# EAGLE schematic reva (EAGLE 9.6.2)

## Sheet 1 of 2
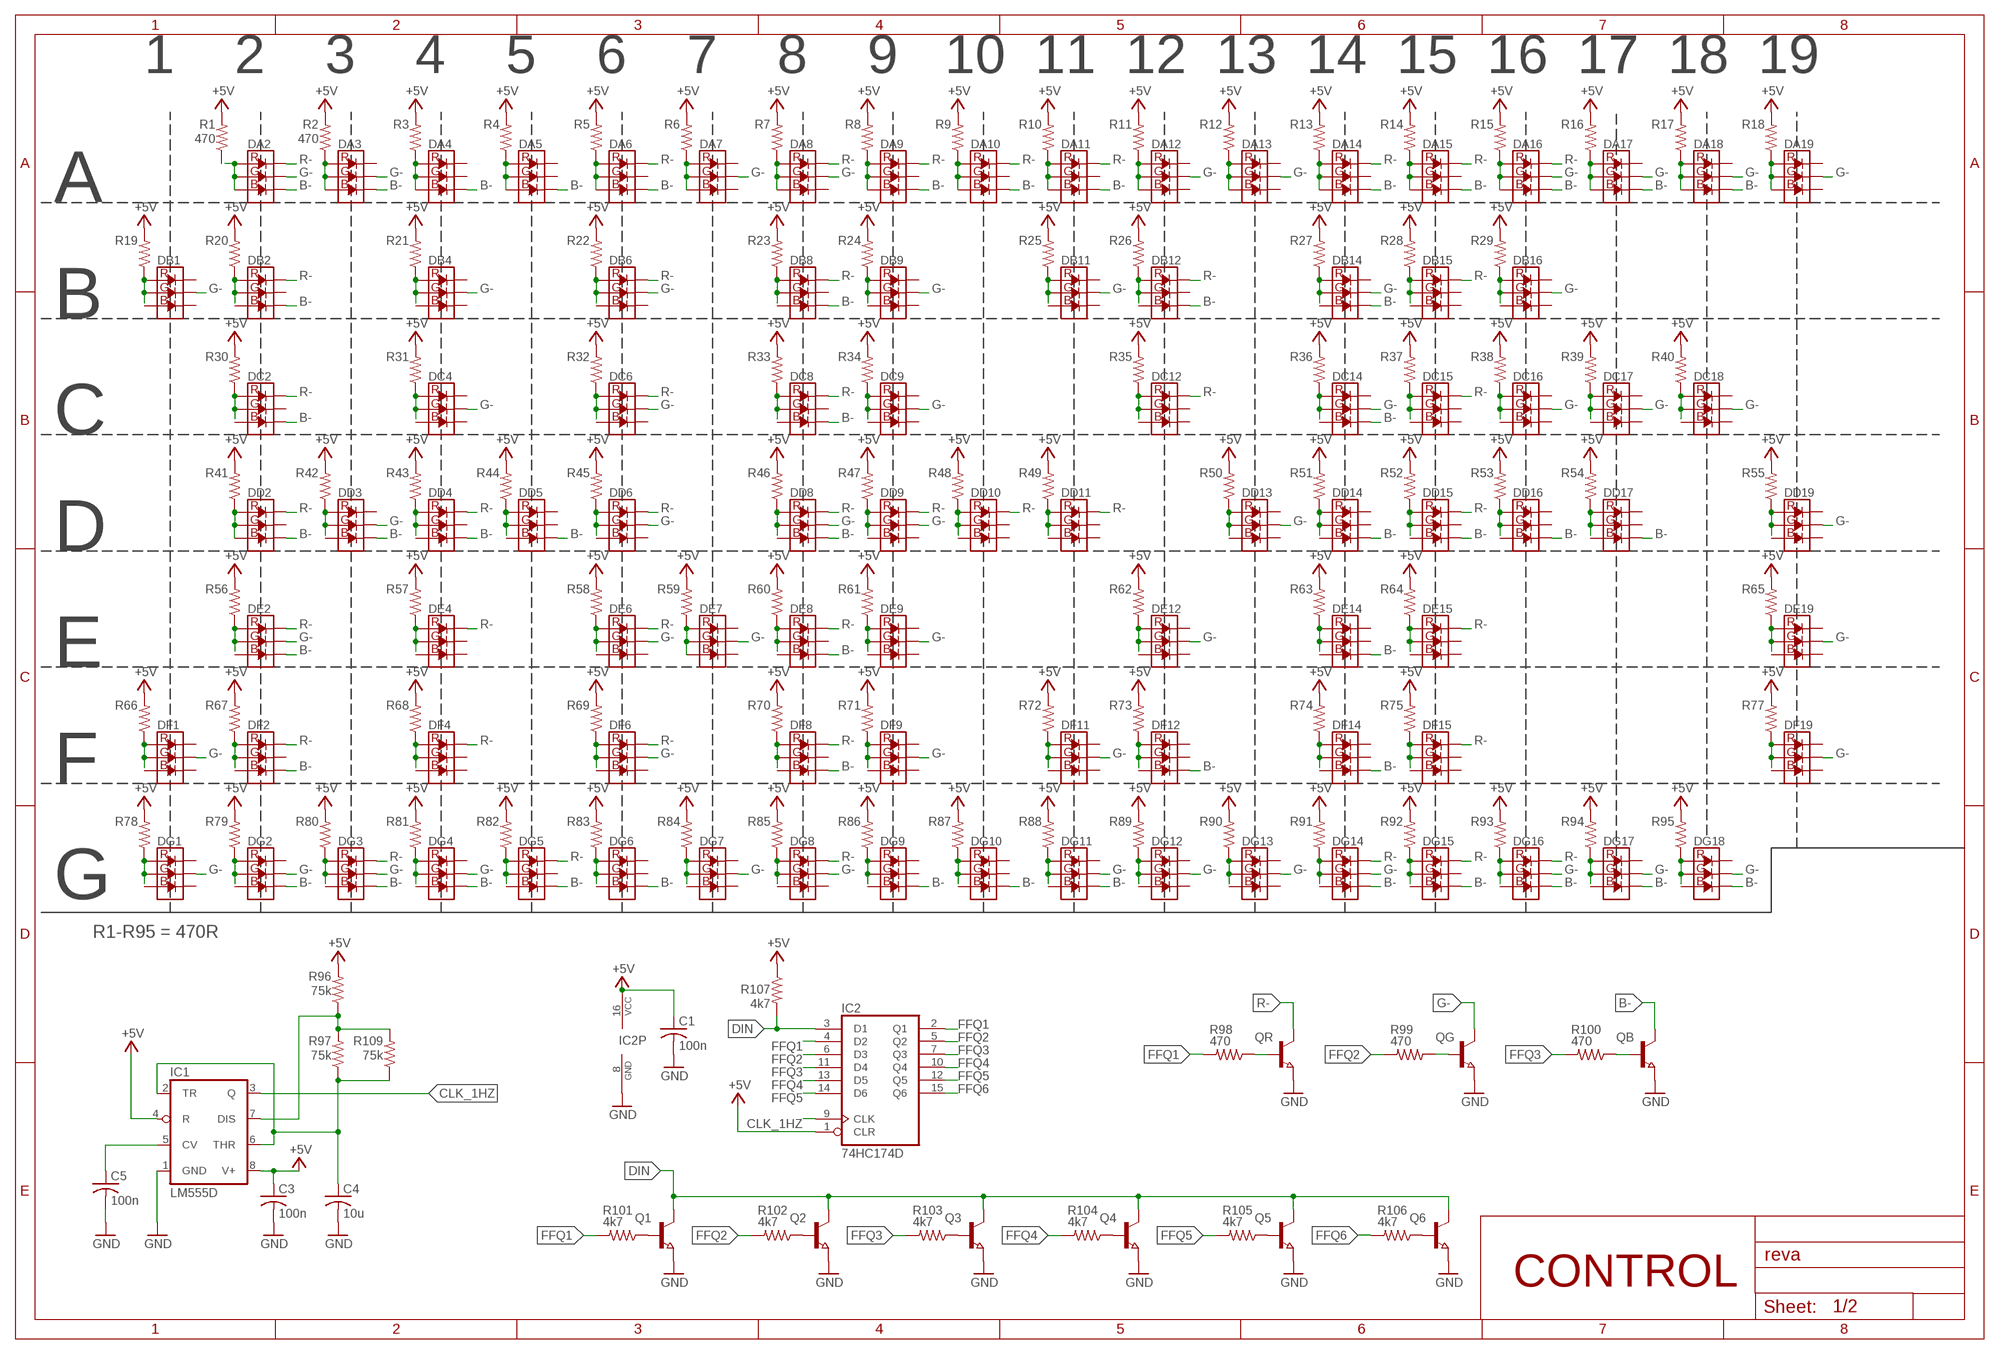
[diagram p0: schematic, sheet 1]

### Parts
C1  100n  C-USC0603  [C0603]
C3  100n  C-USC0603  [C0603]
C4  10u  C-USC0805  [C0805]
C5  100n  C-USC0603  [C0603]
DA2  RGB_LED_XL  [LED2727]
DA3  RGB_LED_XL  [LED2727]
DA4  RGB_LED_XL  [LED2727]
DA5  RGB_LED_XL  [LED2727]
DA6  RGB_LED_XL  [LED2727]
DA7  RGB_LED_XL  [LED2727]
DA8  RGB_LED_XL  [LED2727]
DA9  RGB_LED_XL  [LED2727]
DA10  RGB_LED_XL  [LED2727]
DA11  RGB_LED_XL  [LED2727]
DA12  RGB_LED_XL  [LED2727]
DA13  RGB_LED_XL  [LED2727]
DA14  RGB_LED_XL  [LED2727]
DA15  RGB_LED_XL  [LED2727]
DA16  RGB_LED_XL  [LED2727]
DA17  RGB_LED_XL  [LED2727]
DA18  RGB_LED_XL  [LED2727]
DA19  RGB_LED_XL  [LED2727]
DB1  RGB_LED_XL  [LED2727]
DB2  RGB_LED_XL  [LED2727]
DB4  RGB_LED_XL  [LED2727]
DB6  RGB_LED_XL  [LED2727]
DB8  RGB_LED_XL  [LED2727]
DB9  RGB_LED_XL  [LED2727]
DB11  RGB_LED_XL  [LED2727]
DB12  RGB_LED_XL  [LED2727]
DB14  RGB_LED_XL  [LED2727]
DB15  RGB_LED_XL  [LED2727]
DB16  RGB_LED_XL  [LED2727]
DC2  RGB_LED_XL  [LED2727]
DC4  RGB_LED_XL  [LED2727]
DC6  RGB_LED_XL  [LED2727]
DC8  RGB_LED_XL  [LED2727]
DC9  RGB_LED_XL  [LED2727]
DC12  RGB_LED_XL  [LED2727]
DC14  RGB_LED_XL  [LED2727]
DC15  RGB_LED_XL  [LED2727]
DC16  RGB_LED_XL  [LED2727]
DC17  RGB_LED_XL  [LED2727]
DC18  RGB_LED_XL  [LED2727]
DD2  RGB_LED_XL  [LED2727]
DD3  RGB_LED_XL  [LED2727]
DD4  RGB_LED_XL  [LED2727]
DD5  RGB_LED_XL  [LED2727]
DD6  RGB_LED_XL  [LED2727]
DD8  RGB_LED_XL  [LED2727]
DD9  RGB_LED_XL  [LED2727]
DD10  RGB_LED_XL  [LED2727]
DD11  RGB_LED_XL  [LED2727]
DD13  RGB_LED_XL  [LED2727]
DD14  RGB_LED_XL  [LED2727]
DD15  RGB_LED_XL  [LED2727]
DD16  RGB_LED_XL  [LED2727]
DD17  RGB_LED_XL  [LED2727]
DD19  RGB_LED_XL  [LED2727]
DE2  RGB_LED_XL  [LED2727]
DE4  RGB_LED_XL  [LED2727]
DE6  RGB_LED_XL  [LED2727]
DE7  RGB_LED_XL  [LED2727]
DE8  RGB_LED_XL  [LED2727]
DE9  RGB_LED_XL  [LED2727]
DE12  RGB_LED_XL  [LED2727]
DE14  RGB_LED_XL  [LED2727]
DE15  RGB_LED_XL  [LED2727]
DE19  RGB_LED_XL  [LED2727]
DF1  RGB_LED_XL  [LED2727]
DF2  RGB_LED_XL  [LED2727]
DF4  RGB_LED_XL  [LED2727]
DF6  RGB_LED_XL  [LED2727]
DF8  RGB_LED_XL  [LED2727]
DF9  RGB_LED_XL  [LED2727]
DF11  RGB_LED_XL  [LED2727]
DF12  RGB_LED_XL  [LED2727]
DF14  RGB_LED_XL  [LED2727]
DF15  RGB_LED_XL  [LED2727]
DF19  RGB_LED_XL  [LED2727]
DG1  RGB_LED_XL  [LED2727]
DG2  RGB_LED_XL  [LED2727]
DG3  RGB_LED_XL  [LED2727]
DG4  RGB_LED_XL  [LED2727]
DG5  RGB_LED_XL  [LED2727]
DG6  RGB_LED_XL  [LED2727]
DG7  RGB_LED_XL  [LED2727]
DG8  RGB_LED_XL  [LED2727]
DG9  RGB_LED_XL  [LED2727]
DG10  RGB_LED_XL  [LED2727]
DG11  RGB_LED_XL  [LED2727]
DG12  RGB_LED_XL  [LED2727]
DG13  RGB_LED_XL  [LED2727]
DG14  RGB_LED_XL  [LED2727]
DG15  RGB_LED_XL  [LED2727]
DG16  RGB_LED_XL  [LED2727]
DG17  RGB_LED_XL  [LED2727]
DG18  RGB_LED_XL  [LED2727]
IC1  LM555D  [SO08]
IC2  74HC174D  74LS174D  [SO16]
Q1  NPN-TRANSISTOR_SOT23  [SOT23]
Q2  NPN-TRANSISTOR_SOT23  [SOT23]
Q3  NPN-TRANSISTOR_SOT23  [SOT23]
Q4  NPN-TRANSISTOR_SOT23  [SOT23]
Q5  NPN-TRANSISTOR_SOT23  [SOT23]
Q6  NPN-TRANSISTOR_SOT23  [SOT23]
QB  NPN-TRANSISTOR_SOT23  [SOT23]
QG  NPN-TRANSISTOR_SOT23  [SOT23]
QR  NPN-TRANSISTOR_SOT23  [SOT23]
R1  470  R-US_R0603  [R0603]
R2  470  R-US_R0603  [R0603]
R3  R-US_R0603  [R0603]
R4  R-US_R0603  [R0603]
R5  R-US_R0603  [R0603]
R6  R-US_R0603  [R0603]
R7  R-US_R0603  [R0603]
R8  R-US_R0603  [R0603]
R9  R-US_R0603  [R0603]
R10  R-US_R0603  [R0603]
R11  R-US_R0603  [R0603]
R12  R-US_R0603  [R0603]
R13  R-US_R0603  [R0603]
R14  R-US_R0603  [R0603]
R15  R-US_R0603  [R0603]
R16  R-US_R0603  [R0603]
R17  R-US_R0603  [R0603]
R18  R-US_R0603  [R0603]
R19  R-US_R0603  [R0603]
R20  R-US_R0603  [R0603]
R21  R-US_R0603  [R0603]
R22  R-US_R0603  [R0603]
R23  R-US_R0603  [R0603]
R24  R-US_R0603  [R0603]
R25  R-US_R0603  [R0603]
R26  R-US_R0603  [R0603]
R27  R-US_R0603  [R0603]
R28  R-US_R0603  [R0603]
R29  R-US_R0603  [R0603]
R30  R-US_R0603  [R0603]
R31  R-US_R0603  [R0603]
R32  R-US_R0603  [R0603]
R33  R-US_R0603  [R0603]
R34  R-US_R0603  [R0603]
R35  R-US_R0603  [R0603]
R36  R-US_R0603  [R0603]
R37  R-US_R0603  [R0603]
R38  R-US_R0603  [R0603]
R39  R-US_R0603  [R0603]
R40  R-US_R0603  [R0603]
R41  R-US_R0603  [R0603]
R42  R-US_R0603  [R0603]
R43  R-US_R0603  [R0603]
R44  R-US_R0603  [R0603]
R45  R-US_R0603  [R0603]
R46  R-US_R0603  [R0603]
R47  R-US_R0603  [R0603]
R48  R-US_R0603  [R0603]
R49  R-US_R0603  [R0603]
R50  R-US_R0603  [R0603]
R51  R-US_R0603  [R0603]
R52  R-US_R0603  [R0603]
R53  R-US_R0603  [R0603]
R54  R-US_R0603  [R0603]
R55  R-US_R0603  [R0603]
R56  R-US_R0603  [R0603]
R57  R-US_R0603  [R0603]
R58  R-US_R0603  [R0603]
R59  R-US_R0603  [R0603]
R60  R-US_R0603  [R0603]
R61  R-US_R0603  [R0603]
R62  R-US_R0603  [R0603]
R63  R-US_R0603  [R0603]
R64  R-US_R0603  [R0603]
R65  R-US_R0603  [R0603]
R66  R-US_R0603  [R0603]
R67  R-US_R0603  [R0603]
R68  R-US_R0603  [R0603]
R69  R-US_R0603  [R0603]
R70  R-US_R0603  [R0603]
R71  R-US_R0603  [R0603]
R72  R-US_R0603  [R0603]
R73  R-US_R0603  [R0603]
R74  R-US_R0603  [R0603]
R75  R-US_R0603  [R0603]
R77  R-US_R0603  [R0603]
R78  R-US_R0603  [R0603]
R79  R-US_R0603  [R0603]
R80  R-US_R0603  [R0603]
R81  R-US_R0603  [R0603]
R82  R-US_R0603  [R0603]
R83  R-US_R0603  [R0603]
R84  R-US_R0603  [R0603]
R85  R-US_R0603  [R0603]
R86  R-US_R0603  [R0603]
R87  R-US_R0603  [R0603]
R88  R-US_R0603  [R0603]
R89  R-US_R0603  [R0603]
R90  R-US_R0603  [R0603]
R91  R-US_R0603  [R0603]
R92  R-US_R0603  [R0603]
R93  R-US_R0603  [R0603]
R94  R-US_R0603  [R0603]
R95  R-US_R0603  [R0603]
R96  75k  R-US_R0603  [R0603]
R97  75k  R-US_R0603  [R0603]
R98  470  R-US_R0603  [R0603]
R99  470  R-US_R0603  [R0603]
R100  470  R-US_R0603  [R0603]
R101  4k7  R-US_R0603  [R0603]
R102  4k7  R-US_R0603  [R0603]
R103  4k7  R-US_R0603  [R0603]
R104  4k7  R-US_R0603  [R0603]
R105  4k7  R-US_R0603  [R0603]
R106  4k7  R-US_R0603  [R0603]
R107  4k7  R-US_R0603  [R0603]
R109  75k  R-US_R0603  [R0603]

### Nets
+5V: C1.1 C3.1 IC1.4(R) IC1.8(V+) IC2.1(CLR) IC2.16(VCC) R1.2 R2.2 R3.2 R4.2 R5.2 R6.2 R7.2 R8.2 R9.2 R10.2 R11.2 R12.2 R13.2 R14.2 R15.2 R16.2 R17.2 R18.2 R19.2 R20.2 R21.2 R22.2 R23.2 R24.2 R25.2 R26.2 R27.2 R28.2 R29.2 R30.2 R31.2 R32.2 R33.2 R34.2 R35.2 R36.2 R37.2 R38.2 R39.2 R40.2 R41.2 R42.2 R43.2 R44.2 R45.2 R46.2 R47.2 R48.2 R49.2 R50.2 R51.2 R52.2 R53.2 R54.2 R55.2 R56.2 R57.2 R58.2 R59.2 R60.2 R61.2 R62.2 R63.2 R64.2 R65.2 R66.2 R67.2 R68.2 R69.2 R70.2 R71.2 R72.2 R73.2 R74.2 R75.2 R77.2 R78.2 R79.2 R80.2 R81.2 R82.2 R83.2 R84.2 R85.2 R86.2 R87.2 R88.2 R89.2 R90.2 R91.2 R92.2 R93.2 R94.2 R95.2 R96.2 R107.1 ; also sheet 2
B-: DA2.1(B-) DA3.1(B-) DA4.1(B-) DA5.1(B-) DA6.1(B-) DA9.1(B-) DA10.1(B-) DA11.1(B-) DA14.1(B-) DA15.1(B-) DA16.1(B-) DA17.1(B-) DA18.1(B-) DB2.1(B-) DB8.1(B-) DB12.1(B-) DB14.1(B-) DC2.1(B-) DC8.1(B-) DC14.1(B-) DD2.1(B-) DD3.1(B-) DD4.1(B-) DD5.1(B-) DD8.1(B-) DD14.1(B-) DD15.1(B-) DD16.1(B-) DD17.1(B-) DE2.1(B-) DE8.1(B-) DE14.1(B-) DF2.1(B-) DF8.1(B-) DF12.1(B-) DF14.1(B-) DG2.1(B-) DG3.1(B-) DG4.1(B-) DG5.1(B-) DG6.1(B-) DG9.1(B-) DG10.1(B-) DG11.1(B-) DG14.1(B-) DG15.1(B-) DG16.1(B-) DG17.1(B-) DG18.1(B-) QB.3(C)
CLK_1HZ: IC1.3(Q) IC2.9(CLK)
CV: C5.1 IC1.5(CV)
DIN: IC2.3(D1) Q1.3(C) Q2.3(C) Q3.3(C) Q4.3(C) Q5.3(C) Q6.3(C) R107.2
DIS: IC1.7(DIS) R96.1 R97.2 R109.2
FFQ1: IC2.2(Q1) IC2.4(D2) R98.2 R101.2
FFQ2: IC2.5(Q2) IC2.6(D3) R99.2 R102.2
FFQ3: IC2.7(Q3) IC2.11(D4) R100.2 R103.2
FFQ4: IC2.10(Q4) IC2.13(D5) R104.2
FFQ5: IC2.12(Q5) IC2.14(D6) R105.2
FFQ6: IC2.15(Q6) R106.2
G-: DA2.2(G-) DA3.2(G-) DA7.2(G-) DA8.2(G-) DA12.2(G-) DA13.2(G-) DA16.2(G-) DA17.2(G-) DA18.2(G-) DA19.2(G-) DB1.2(G-) DB4.2(G-) DB6.2(G-) DB9.2(G-) DB11.2(G-) DB14.2(G-) DB16.2(G-) DC4.2(G-) DC6.2(G-) DC9.2(G-) DC14.2(G-) DC16.2(G-) DC17.2(G-) DC18.2(G-) DD3.2(G-) DD6.2(G-) DD8.2(G-) DD9.2(G-) DD13.2(G-) DD19.2(G-) DE2.2(G-) DE6.2(G-) DE7.2(G-) DE9.2(G-) DE12.2(G-) DE19.2(G-) DF1.2(G-) DF6.2(G-) DF9.2(G-) DF11.2(G-) DF19.2(G-) DG1.2(G-) DG2.2(G-) DG3.2(G-) DG4.2(G-) DG7.2(G-) DG8.2(G-) DG11.2(G-) DG12.2(G-) DG13.2(G-) DG14.2(G-) DG16.2(G-) DG17.2(G-) DG18.2(G-) QG.3(C)
GND: C1.2 C3.2 C4.2 C5.2 IC1.1(GND) IC2.8(GND) Q1.2(E) Q2.2(E) Q3.2(E) Q4.2(E) Q5.2(E) Q6.2(E) QB.2(E) QG.2(E) QR.2(E) ; also sheet 2
N$1: DA2.4(R+) DA2.5(G+) DA2.6(B+) R1.1
N$2: DA3.4(R+) DA3.5(G+) DA3.6(B+) R2.1
N$3: DA4.4(R+) DA4.5(G+) DA4.6(B+) R3.1
N$4: DA5.4(R+) DA5.5(G+) DA5.6(B+) R4.1
N$5: DA6.4(R+) DA6.5(G+) DA6.6(B+) R5.1
N$6: DA7.4(R+) DA7.5(G+) DA7.6(B+) R6.1
N$7: DA8.4(R+) DA8.5(G+) DA8.6(B+) R7.1
N$8: DA9.4(R+) DA9.5(G+) DA9.6(B+) R8.1
N$9: DA10.4(R+) DA10.5(G+) DA10.6(B+) R9.1
N$10: DA11.4(R+) DA11.5(G+) DA11.6(B+) R10.1
N$11: DA12.4(R+) DA12.5(G+) DA12.6(B+) R11.1
N$12: DA13.4(R+) DA13.5(G+) DA13.6(B+) R12.1
N$13: DA14.4(R+) DA14.5(G+) DA14.6(B+) R13.1
N$14: DA15.4(R+) DA15.5(G+) DA15.6(B+) R14.1
N$15: DA16.4(R+) DA16.5(G+) DA16.6(B+) R15.1
N$16: DA17.4(R+) DA17.5(G+) DA17.6(B+) R16.1
N$17: DA18.4(R+) DA18.5(G+) DA18.6(B+) R17.1
N$18: DA19.4(R+) DA19.5(G+) DA19.6(B+) R18.1
N$19: DB1.4(R+) DB1.5(G+) DB1.6(B+) R19.1
N$20: DB2.4(R+) DB2.5(G+) DB2.6(B+) R20.1
N$21: DB4.4(R+) DB4.5(G+) DB4.6(B+) R21.1
N$22: DB6.4(R+) DB6.5(G+) DB6.6(B+) R22.1
N$23: DB8.4(R+) DB8.5(G+) DB8.6(B+) R23.1
N$24: DB9.4(R+) DB9.5(G+) DB9.6(B+) R24.1
N$25: DB11.4(R+) DB11.5(G+) DB11.6(B+) R25.1
N$26: DB12.4(R+) DB12.5(G+) DB12.6(B+) R26.1
N$27: DB14.4(R+) DB14.5(G+) DB14.6(B+) R27.1
N$28: DB15.4(R+) DB15.5(G+) DB15.6(B+) R28.1
N$29: DB16.4(R+) DB16.5(G+) DB16.6(B+) R29.1
N$30: DC2.4(R+) DC2.5(G+) DC2.6(B+) R30.1
N$31: DC4.4(R+) DC4.5(G+) DC4.6(B+) R31.1
N$32: DC6.4(R+) DC6.5(G+) DC6.6(B+) R32.1
N$33: DC8.4(R+) DC8.5(G+) DC8.6(B+) R33.1
N$34: DC9.4(R+) DC9.5(G+) DC9.6(B+) R34.1
N$35: DC12.4(R+) DC12.5(G+) DC12.6(B+) R35.1
N$36: DC14.4(R+) DC14.5(G+) DC14.6(B+) R36.1
N$37: DC15.4(R+) DC15.5(G+) DC15.6(B+) R37.1
N$38: DC16.4(R+) DC16.5(G+) DC16.6(B+) R38.1
N$39: DC17.4(R+) DC17.5(G+) DC17.6(B+) R39.1
N$40: DC18.4(R+) DC18.5(G+) DC18.6(B+) R40.1
N$41: DD2.4(R+) DD2.5(G+) DD2.6(B+) R41.1
N$42: DD3.4(R+) DD3.5(G+) DD3.6(B+) R42.1
N$43: DD4.4(R+) DD4.5(G+) DD4.6(B+) R43.1
N$44: DD5.4(R+) DD5.5(G+) DD5.6(B+) R44.1
N$45: DD6.4(R+) DD6.5(G+) DD6.6(B+) R45.1
N$46: DD8.4(R+) DD8.5(G+) DD8.6(B+) R46.1
N$47: DD9.4(R+) DD9.5(G+) DD9.6(B+) R47.1
N$48: DD10.4(R+) DD10.5(G+) DD10.6(B+) R48.1
N$49: DD11.4(R+) DD11.5(G+) DD11.6(B+) R49.1
N$50: DD13.4(R+) DD13.5(G+) DD13.6(B+) R50.1
N$51: DD14.4(R+) DD14.5(G+) DD14.6(B+) R51.1
N$52: DD15.4(R+) DD15.5(G+) DD15.6(B+) R52.1
N$53: DD16.4(R+) DD16.5(G+) DD16.6(B+) R53.1
N$54: DD17.4(R+) DD17.5(G+) DD17.6(B+) R54.1
N$55: DD19.4(R+) DD19.5(G+) DD19.6(B+) R55.1
N$56: DE2.4(R+) DE2.5(G+) DE2.6(B+) R56.1
N$57: DE4.4(R+) DE4.5(G+) DE4.6(B+) R57.1
N$58: DE6.4(R+) DE6.5(G+) DE6.6(B+) R58.1
N$59: DE7.4(R+) DE7.5(G+) DE7.6(B+) R59.1
N$60: DE8.4(R+) DE8.5(G+) DE8.6(B+) R60.1
N$61: DE9.4(R+) DE9.5(G+) DE9.6(B+) R61.1
N$62: DE12.4(R+) DE12.5(G+) DE12.6(B+) R62.1
N$63: DE14.4(R+) DE14.5(G+) DE14.6(B+) R63.1
N$64: DE15.4(R+) DE15.5(G+) DE15.6(B+) R64.1
N$65: DE19.4(R+) DE19.5(G+) DE19.6(B+) R65.1
N$66: DF1.4(R+) DF1.5(G+) DF1.6(B+) R66.1
N$67: DF2.4(R+) DF2.5(G+) DF2.6(B+) R67.1
N$68: DF4.4(R+) DF4.5(G+) DF4.6(B+) R68.1
N$69: DF6.4(R+) DF6.5(G+) DF6.6(B+) R69.1
N$70: DF8.4(R+) DF8.5(G+) DF8.6(B+) R70.1
N$71: DF9.4(R+) DF9.5(G+) DF9.6(B+) R71.1
N$72: DF11.4(R+) DF11.5(G+) DF11.6(B+) R72.1
N$73: DF12.4(R+) DF12.5(G+) DF12.6(B+) R73.1
N$74: DF14.4(R+) DF14.5(G+) DF14.6(B+) R74.1
N$75: DF15.4(R+) DF15.5(G+) DF15.6(B+) R75.1
N$77: DF19.4(R+) DF19.5(G+) DF19.6(B+) R77.1
N$78: DG1.4(R+) DG1.5(G+) DG1.6(B+) R78.1
N$79: DG2.4(R+) DG2.5(G+) DG2.6(B+) R79.1
N$80: DG3.4(R+) DG3.5(G+) DG3.6(B+) R80.1
N$81: DG4.4(R+) DG4.5(G+) DG4.6(B+) R81.1
N$82: DG5.4(R+) DG5.5(G+) DG5.6(B+) R82.1
N$83: DG6.4(R+) DG6.5(G+) DG6.6(B+) R83.1
N$84: DG7.4(R+) DG7.5(G+) DG7.6(B+) R84.1
N$85: DG8.4(R+) DG8.5(G+) DG8.6(B+) R85.1
N$86: DG9.4(R+) DG9.5(G+) DG9.6(B+) R86.1
N$87: DG10.4(R+) DG10.5(G+) DG10.6(B+) R87.1
N$88: DG11.4(R+) DG11.5(G+) DG11.6(B+) R88.1
N$89: DG12.4(R+) DG12.5(G+) DG12.6(B+) R89.1
N$90: DG13.4(R+) DG13.5(G+) DG13.6(B+) R90.1
N$91: DG14.4(R+) DG14.5(G+) DG14.6(B+) R91.1
N$92: DG15.4(R+) DG15.5(G+) DG15.6(B+) R92.1
N$93: DG16.4(R+) DG16.5(G+) DG16.6(B+) R93.1
N$94: DG17.4(R+) DG17.5(G+) DG17.6(B+) R94.1
N$95: DG18.4(R+) DG18.5(G+) DG18.6(B+) R95.1
Q1B: Q1.1(B) R101.1
Q2B: Q2.1(B) R102.1
Q3B: Q3.1(B) R103.1
Q4B: Q4.1(B) R104.1
Q5B: Q5.1(B) R105.1
Q6B: Q6.1(B) R106.1
QBB: QB.1(B) R100.1
QGB: QG.1(B) R99.1
QRB: QR.1(B) R98.1
R-: DA2.3(R-) DA6.3(R-) DA8.3(R-) DA9.3(R-) DA10.3(R-) DA11.3(R-) DA14.3(R-) DA15.3(R-) DA16.3(R-) DB2.3(R-) DB6.3(R-) DB8.3(R-) DB12.3(R-) DB15.3(R-) DC2.3(R-) DC6.3(R-) DC8.3(R-) DC12.3(R-) DC15.3(R-) DD2.3(R-) DD4.3(R-) DD6.3(R-) DD8.3(R-) DD9.3(R-) DD10.3(R-) DD11.3(R-) DD15.3(R-) DE2.3(R-) DE4.3(R-) DE6.3(R-) DE8.3(R-) DE15.3(R-) DF2.3(R-) DF4.3(R-) DF6.3(R-) DF8.3(R-) DF15.3(R-) DG3.3(R-) DG5.3(R-) DG8.3(R-) DG14.3(R-) DG15.3(R-) DG16.3(R-) QR.3(C)
TR: C4.1 IC1.2(TR) IC1.6(THR) R97.1 R109.1
Unconnected: DA3.3(R-) DA4.2(G-) DA4.3(R-) DA5.2(G-) DA5.3(R-) DA6.2(G-) DA7.1(B-) DA7.3(R-) DA8.1(B-) DA9.2(G-) DA10.2(G-) DA11.2(G-) DA12.1(B-) DA12.3(R-) DA13.1(B-) DA13.3(R-) DA14.2(G-) DA15.2(G-) DA17.3(R-) DA18.3(R-) DA19.1(B-) DA19.3(R-) DB1.1(B-) DB1.3(R-) DB2.2(G-) DB4.1(B-) DB4.3(R-) DB6.1(B-) DB8.2(G-) DB9.1(B-) DB9.3(R-) DB11.1(B-) DB11.3(R-) DB12.2(G-) DB14.3(R-) DB15.1(B-) DB15.2(G-) DB16.1(B-) DB16.3(R-) DC2.2(G-) DC4.1(B-) DC4.3(R-) DC6.1(B-) DC8.2(G-) DC9.1(B-) DC9.3(R-) DC12.1(B-) DC12.2(G-) DC14.3(R-) DC15.1(B-) DC15.2(G-) DC16.1(B-) DC16.3(R-) DC17.1(B-) DC17.3(R-) DC18.1(B-) DC18.3(R-) DD2.2(G-) DD3.3(R-) DD4.2(G-) DD5.2(G-) DD5.3(R-) DD6.1(B-) DD9.1(B-) DD10.1(B-) DD10.2(G-) DD11.1(B-) DD11.2(G-) DD13.1(B-) DD13.3(R-) DD14.2(G-) DD14.3(R-) DD15.2(G-) DD16.2(G-) DD16.3(R-) DD17.2(G-) DD17.3(R-) DD19.1(B-) DD19.3(R-) DE4.1(B-) DE4.2(G-) DE6.1(B-) DE7.1(B-) DE7.3(R-) DE8.2(G-) DE9.1(B-) DE9.3(R-) DE12.1(B-) DE12.3(R-) DE14.2(G-) DE14.3(R-) DE15.1(B-) DE15.2(G-) DE19.1(B-) DE19.3(R-) DF1.1(B-) DF1.3(R-) DF2.2(G-) DF4.1(B-) DF4.2(G-) DF6.1(B-) DF8.2(G-) DF9.1(B-) DF9.3(R-) DF11.1(B-) DF11.3(R-) DF12.2(G-) DF12.3(R-) DF14.2(G-) DF14.3(R-) DF15.1(B-) DF15.2(G-) DF19.1(B-) DF19.3(R-) DG1.1(B-) DG1.3(R-) DG2.3(R-) DG4.3(R-) DG5.2(G-) DG6.2(G-) DG6.3(R-) DG7.1(B-) DG7.3(R-) DG8.1(B-) DG9.2(G-) DG9.3(R-) DG10.2(G-) DG10.3(R-) DG11.3(R-) DG12.1(B-) DG12.3(R-) DG13.1(B-) DG13.3(R-) DG15.2(G-) DG17.3(R-) DG18.3(R-)

### Notes on the sheet
- 1 | 2 | 3 | 4 | 5 | 6 | 7 | 8 | 9 | 10 | 11 | 12 | 13 | 14 | 15 | 16 | 17 | 17 | 18 | 19
- A
- B
- C
- D
- E
- F
- G
- R1-R95 = 470R
- CONTROL

## Sheet 2 of 2
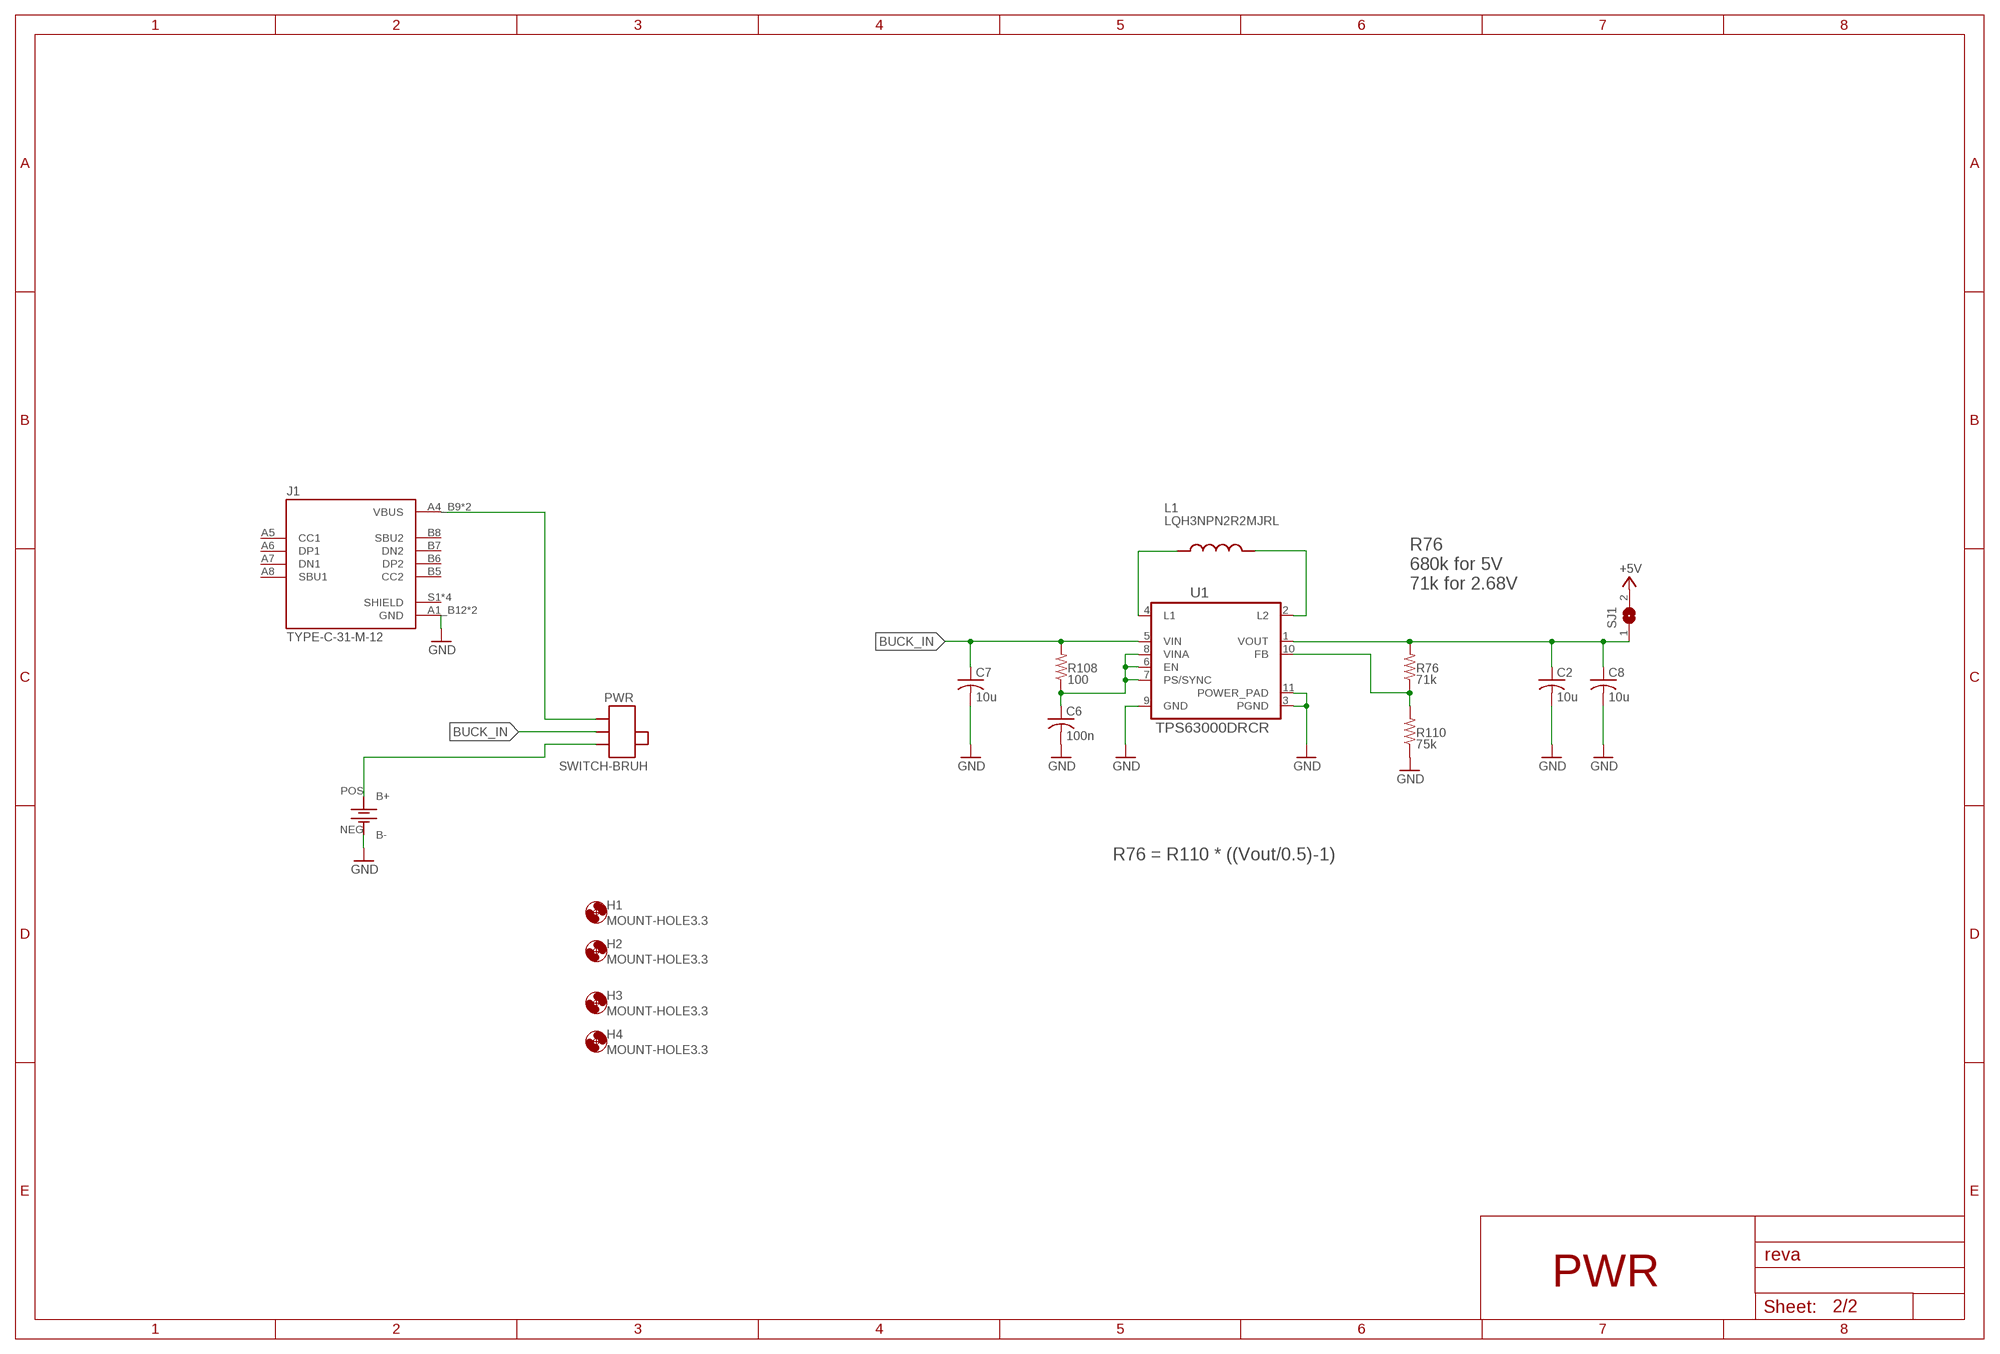
[diagram p1: schematic, sheet 2]

### Parts
BAT1  CR2450  [CR240_CASE]
C2  10u  C-USC0805  [C0805]
C6  100n  C-USC0603  [C0603]
C7  10u  C-USC0805  [C0805]
C8  10u  C-USC0805  [C0805]
H1  MOUNT-HOLE3.3  [3,3]
H2  MOUNT-HOLE3.3  [3,3]
H3  MOUNT-HOLE3.3  [3,3]
H4  MOUNT-HOLE3.3  [3,3]
J1  TYPE-C-31-M-12  [HRO_TYPE-C-31-M-12]
L1  LQH3NPN2R2MJRL  [IND_LQH3NPN2R2MJRL]
PWR  SWITCH-BRUH  [SW-K31391B]
R76  71k  R-US_R0603  [R0603]
R108  100  R-US_R0603  [R0603]
R110  75k  R-US_R0603  [R0603]
SJ1  SJ  [SJ]
U1  TPS63000DRCR  TPS63001DRCR  [VREG_V62/16624-01YE]

### Nets
5VBUCK: C2.1 C8.1 R76.2 SJ1.1 U1.1(VOUT)
+5V: SJ1.2 ; also sheet 1
BUCK_IN: C7.1 PWR.COM(C) R108.2 U1.5(VIN)
GND: BAT1.NEG(B-) C2.2 C6.2 C7.2 C8.2 J1.A1_B12(GND) J1.B1_A12(GND) R110.1 U1.3(PGND) U1.9(GND) U1.11(POWER_PAD) ; also sheet 1
L1: L1.1 U1.4(L1)
L2: L1.2 U1.2(L2)
N$76: R76.1 R110.2 U1.10(FB)
N$103: J1.A4_B9(VBUS) J1.B4_A9(VBUS) PWR.L(T1)
N$104: BAT1.POS(B+) PWR.R(T2)
VINA: C6.1 R108.1 U1.6(EN) U1.7(PS/SYNC) U1.8(VINA)
Unconnected: J1.A5(CC1) J1.A6(DP1) J1.A7(DN1) J1.A8(SBU1) J1.B5(CC2) J1.B6(DP2) J1.B7(DN2) J1.B8(SBU2) J1.S1(SHIELD) J1.S2(SHIELD) J1.S3(SHIELD) J1.S4(SHIELD)

### Notes on the sheet
- R76
  680k for 5V
  71k for 2.68V
- R76 = R110 * ((Vout/0.5)-1)
- PWR

## Library data of the parts
BAT1 = flashing_ece_2025:CR2450
C1-C8 = adafruit:C-US: CAPACITOR, American symbol
DA2-DA19 DB1 DB2 DB4 DB6 DB8 DB9 DB11 DB12 DB14-DB16 DC2 DC4 DC6 DC8 DC9 DC12 DC14-DC18 DD2-DD6 DD8-DD11 DD13-DD17 DD19 DE2 DE4 DE6-DE9 DE12 DE14 DE15 DE19 DF1 DF2 DF4 DF6 DF8 DF9 DF11 DF12 DF14 DF15 DF19 DG1-DG18 = flashing_ece_2025:RGB_LED_XL
H1-H4 = holes:MOUNT-HOLE: MOUNTING HOLE with drill center marker
IC1 = adafruit:*555: TIMER Changed DIP package to have round (not oval) pin pads http://www.ladyada.net/library/pcb/eaglelibrary.html
IC2 = 74xx-us:74*174: Hex D type FLIP FLOP, clear
J1 = TYPE-C-31-M-12:TYPE-C-31-M-12: Check availability <https://pricing.snapeda.com/parts/TYPE-C-31-M-12/HRO%20Electronics%20Co.%2C%20Ltd./view-part?ref=eda>; AVAILABILITY: Not in stock; CHECK_PRICES: https://www.snapeda.com/parts/TYPE-C-31-M-12/HRO+Electronics+Co.%252C+Ltd./view-part/?ref=eda; DESCRIPTION: USB Connectors 24 Receptacle 1 8.94*7.3mm RoHS; MF: HRO Electronics Co., Ltd.; MP: TYPE-C-31-M-12; PACKAGE: Package; PRICE: None; SNAPEDA_LINK: https://www.snapeda.com/parts/TYPE-C-31-M-12/HRO+Electronics+Co.%252C+Ltd./view-part/?ref=snap
L1 = LQH3NPN2R2MJRL:LQH3NPN2R2MJRL: Inductor Power Chip Shielded Wirewound 33uH 20% 1MHz Ferrite 0.63A 0.948Ohm DCR 1212 T/R; MANUFACTURER: Murata; MAXIMUM_PACKAGE_HEIGHT: 1.2mm; PARTREV: N/A; STANDARD: Manufacturer Recommendations
PWR = flashing_ece_2025:SWITCH-BRUH
Q1-Q6 QB QG QR = semicon-smd-ipc:NPN-TRANSISTOR_: NPN TRANSISTOR
R1-R110 = adafruit:R-US_: RESISTOR, American symbol
SJ1 = jumper:SJ: SMD solder JUMPER
U1 = TPS63001DRCR:TPS63001DRCR